# Altium schematic sheet LED_RED_Direct_BRIGHT.SchDoc
size A4; SheetNumber: 5; SheetTotal: 29
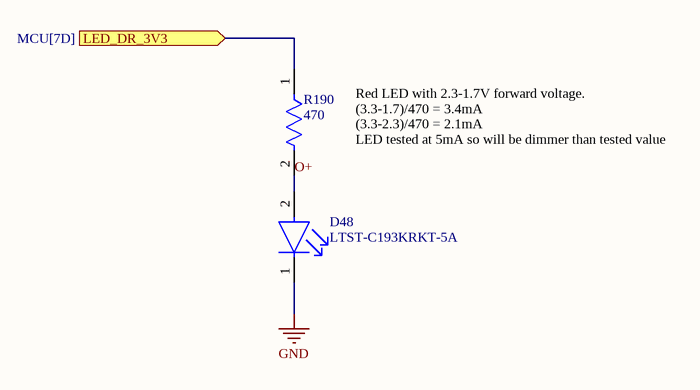
[diagram p0: LED_RED_Direct_BRIGHT.SchDoc]

## Parts
D48  LTST-C193KRKT-5A  [FP-LTST-C193KRKT-5A-MFG]
R190  value 470  [FP-CRGCQ0603-IPC_A]  (hidden comment: CRGCQ0603J470R)

## Ports
LED_DR_3V3 (in, see MCU[7D])

## Nets
GND: D48.1(C)
LED_DR_3V3: R190.1 ; port LED_DR_3V3
O+: D48.2(A) R190.2

## Notes on the sheet
- Red LED with 2.3-1.7V forward voltage.
  (3.3-1.7)/470 = 3.4mA
  (3.3-2.3)/470 = 2.1mA
  LED tested at 5mA so will be dimmer than tested value

## Library data of the parts
D48 = CMP-007-00039-1: Single-color LEDs; LITEON; LTST-C193KRKT-5A; Red; 130 °; 2.3 V; 0603; Viewing Angle: 130°; Lens Transparency: Clear; Test Current: 5mA; Power Dissipation: 50mW; Forward Voltage: 2.3V; Wavelength: 631nm; Lens Color: Clear, Colorless; Luminous Intensity: 26.05mcd; Number of LEDs: 1; Shape: Rectangular; Lens Style: Clear, Colorless, Diffused, Rectangular; Forward Current: 20mA; Reverse Voltage: 5V; Peak Wavelength: 639nm; RoHS: Compliant; Length: 1.6mm; Pins: 2; Lifecycle Status: Production; Harmonized Tariff Schedule (HTS) Code: 8541.40.20.00; Height: 350µm; Case Code (Imperial): 0603; Country of Origin: Mainland China, Thailand; Width: 800µm; Mounting Technology: Surface Mount; REACH SVHC: Yes; Lead Free: Lead Free; Export Control Classification Number (ECCN) Code: EAR99; Radiation Hardening: No; Case/Package: 0603; Depth: 800µm; Dominant Wavelength: 631nm; Illumination Color: Red; Min Operating Temperature: -30°C; Introduction Date: 2008-09-01; Number of Elements: 1; Number of Terminals: 2; Number of Circuits: 1; Schedule B: 8541402000, 8541402000; Case Code (Metric): 1608; Max Operating Temperature: 85°C; Color: Red; Terminal Pitch: 1.5mm; China RoHS: Compliant
R190 = CMP-009-00304-1: Res Thick Film 0603 470 Ohm 5% 0.1W(1/10W) ±100ppm/°C Pad SMD T/R Automotive AEC-Q200; Manufacturer Lifecycle Status: ACTIVE; Working Voltage: 75V; Power Rating: 100mW; RoHS: Compliant; Lifecycle Status: Production; Voltage Rating: 75V; Number of Terminals: 2; Packaging: Cut Tape; Width: 800µm; Height: 450µm; Min Operating Temperature: -55°C; Introduction Date: 2019-08-26; Ambient Temperature Range High: 70°C; Voltage Rating (DC): 75V; Max Operating Temperature: 155°C; China RoHS: Non-Compliant; Operating Supply Voltage: 75V; Schedule B: 8533210025, 8533210025; Tolerance: 5%; REACH SVHC: Yes; Ratings: AEC-Q200; Harmonized Tariff Schedule (HTS) Code: 8533.21.00.30; Mounting Technology: Surface Mount; Composition: Thick Film; Temperature Coefficient: 100ppm/°C; Case/Package: 0603; Export Control Classification Number (ECCN) Code: EAR99; Length: 1.6mm